# EAGLE schematic main (EAGLE 9.6.0)
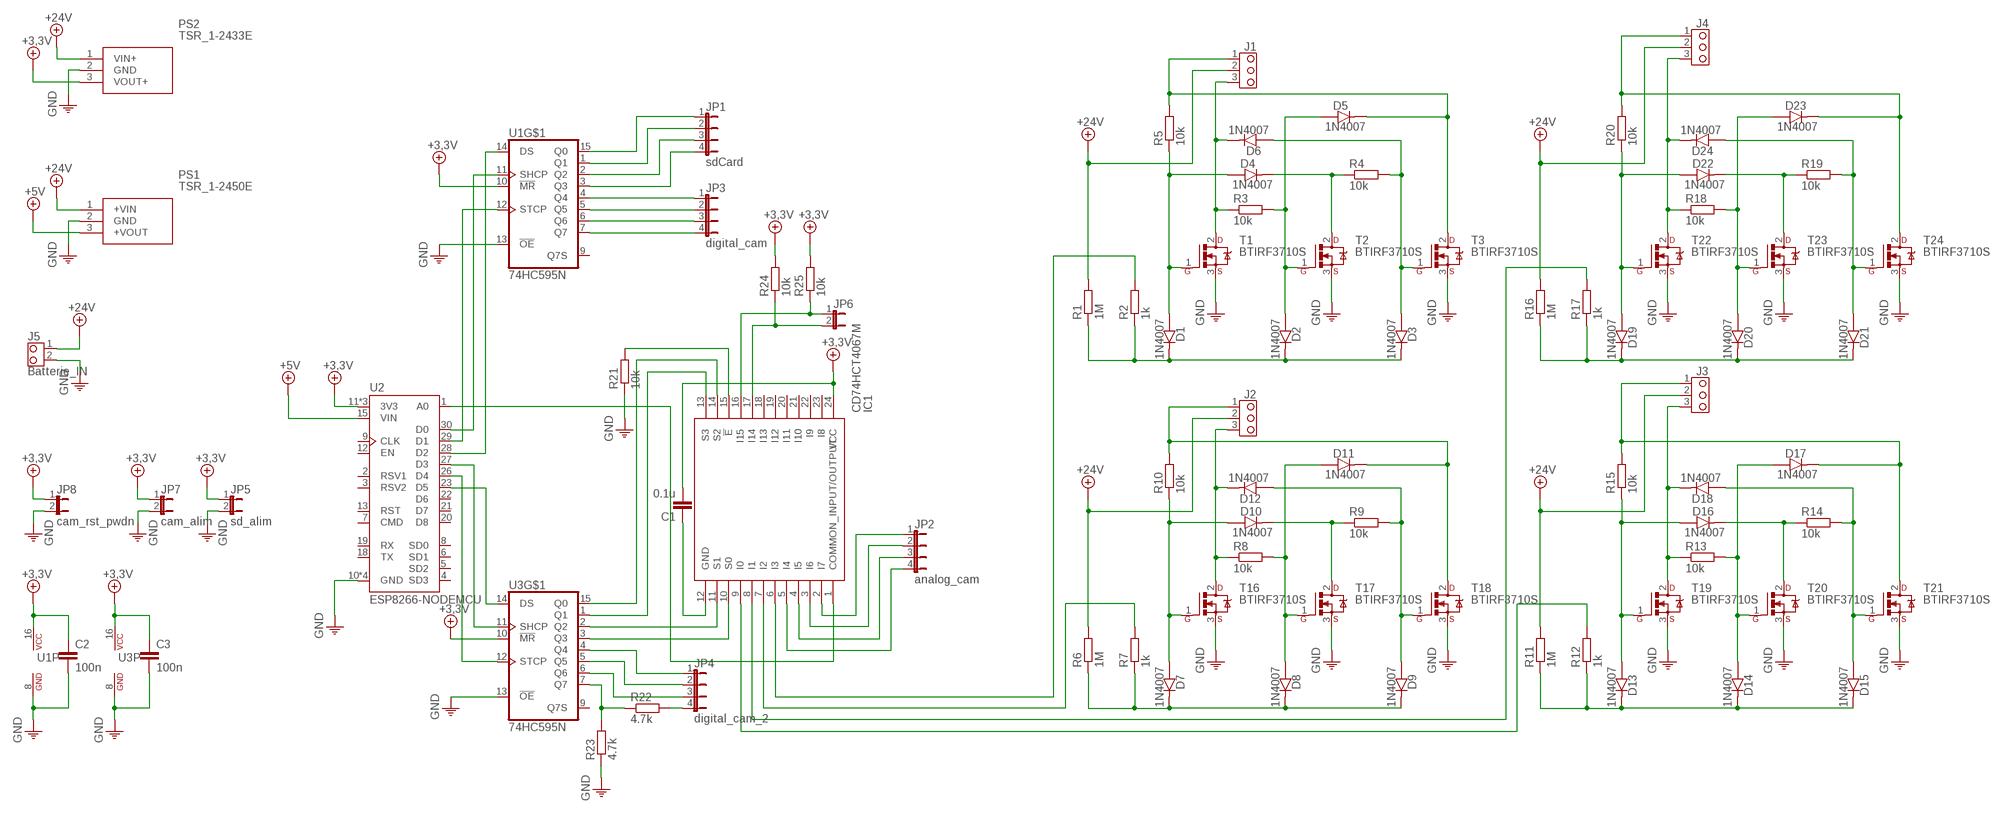
[diagram p0: schematic, sheet 1]

## Parts
C1  0.1u  C-CMS1206  [CCMS1206]
C2  100n  C-CMS1206  [CCMS1206]
C3  100n  C-CMS1206  [CCMS1206]
D1  1N4007  [DO-41-10]
D2  1N4007  [DO-41-10]
D3  1N4007  [DO-41-10]
D4  1N4007  [DO-41-10]
D5  1N4007  [DO-41-10]
D6  1N4007  [DO-41-10]
D7  1N4007  [DO-41-10]
D8  1N4007  [DO-41-10]
D9  1N4007  [DO-41-10]
D10  1N4007  [DO-41-10]
D11  1N4007  [DO-41-10]
D12  1N4007  [DO-41-10]
D13  1N4007  [DO-41-10]
D14  1N4007  [DO-41-10]
D15  1N4007  [DO-41-10]
D16  1N4007  [DO-41-10]
D17  1N4007  [DO-41-10]
D18  1N4007  [DO-41-10]
D19  1N4007  [DO-41-10]
D20  1N4007  [DO-41-10]
D21  1N4007  [DO-41-10]
D22  1N4007  [DO-41-10]
D23  1N4007  [DO-41-10]
D24  1N4007  [DO-41-10]
IC1  CD74HCT4067M  [SOIC127P1030X265-24N]
J1  BORNIER_3-A3P  [AK500/3]
J2  BORNIER_3-A3P  [AK500/3]
J3  BORNIER_3-A3P  [AK500/3]
J4  BORNIER_3-A3P  [AK500/3]
J5  Batterie_IN  BORNIER_2-D2P  [MSTBA2]
JP1  sdCard  JP4E  [JP4]
JP2  analog_cam  JP4E  [JP4]
JP3  digital_cam  JP4E  [JP4]
JP4  digital_cam_2  JP4E  [JP4]
JP5  sd_alim  JP1E  [JP1]
JP6  JP1E  [JP1]
JP7  cam_alim  JP1E  [JP1]
JP8  cam_rst_pwdn  JP1E  [JP1]
PS1  TSR_1-2450E  [TSR12450E]
PS2  TSR_1-2433E  [TSR-1-2433]
R1  1M  R-CMS1206  [RCMS1206]
R2  1k  R-CMS1206  [RCMS1206]
R3  10k  R-CMS1206  [RCMS1206]
R4  10k  R-CMS1206  [RCMS1206]
R5  10k  R-CMS1206  [RCMS1206]
R6  1M  R-CMS1206  [RCMS1206]
R7  1k  R-CMS1206  [RCMS1206]
R8  10k  R-CMS1206  [RCMS1206]
R9  10k  R-CMS1206  [RCMS1206]
R10  10k  R-CMS1206  [RCMS1206]
R11  1M  R-CMS1206  [RCMS1206]
R12  1k  R-CMS1206  [RCMS1206]
R13  10k  R-CMS1206  [RCMS1206]
R14  10k  R-CMS1206  [RCMS1206]
R15  10k  R-CMS1206  [RCMS1206]
R16  1M  R-CMS1206  [RCMS1206]
R17  1k  R-CMS1206  [RCMS1206]
R18  10k  R-CMS1206  [RCMS1206]
R19  10k  R-CMS1206  [RCMS1206]
R20  10k  R-CMS1206  [RCMS1206]
R21  10k  R-CMS1206  [RCMS1206]
R22  4.7k  R-CMS1206  [RCMS1206]
R23  4.7k  R-CMS1206  [RCMS1206]
R24  10k  R-CMS1206  [RCMS1206]
R25  10k  R-CMS1206  [RCMS1206]
T1  BTIRF3710S  [D2PACK]
T2  BTIRF3710S  [D2PACK]
T3  BTIRF3710S  [D2PACK]
T16  BTIRF3710S  [D2PACK]
T17  BTIRF3710S  [D2PACK]
T18  BTIRF3710S  [D2PACK]
T19  BTIRF3710S  [D2PACK]
T20  BTIRF3710S  [D2PACK]
T21  BTIRF3710S  [D2PACK]
T22  BTIRF3710S  [D2PACK]
T23  BTIRF3710S  [D2PACK]
T24  BTIRF3710S  [D2PACK]
U1  74HC595N  [DIL16]
U2  ESP8266-NODEMCU  [ESP8266-NODEMCU]
U3  74HC595N  [DIL16]

## Nets
+3,3V: C1.2 C2.1 C3.1 IC1.24(VCC) JP5.1 JP7.1 JP8.1 PS2.3(VOUT+) R24.2 R25.2 U1.10(!MR!) U1.16(P:VCC) U2.11(3V3) U2.16(3V3) U2.25(3V3) U3.10(!MR!) U3.16(P:VCC)
+5V: PS1.3(+VOUT) U2.15(VIN)
+24V: J1.2 J2.2 J3.2 J4.2 J5.1 PS1.1(+VIN) PS2.1(VIN+) R1.2 R6.2 R11.2 R16.2
GND: C2.2 C3.2 J5.2 JP5.2 JP7.2 JP8.2 PS1.2(GND) PS2.2(GND) R21.1 R23.1 T1.3(S) T2.3(S) T3.3(S) T16.3(S) T17.3(S) T18.3(S) T19.3(S) T20.3(S) T21.3(S) T22.3(S) T23.3(S) T24.3(S) U1.8(P:GND) U1.13(!OE!) U2.10(GND) U2.14(GND) U2.17(GND) U2.24(GND) U3.8(P:GND) U3.13(!OE!)
N$1: D4.C R4.1 T2.2(D)
N$2: D1.C D2.C D3.C R1.1 R2.1
N$3: D1.A D4.A R5.1 T1.1(G)
N$4: D2.A D5.A R3.2 T2.1(G)
N$5: D3.A D6.A R4.2 T3.1(G)
N$6: D6.C J1.3 R3.1 T1.2(D)
N$7: IC1.6(I3) R2.2
N$8: D7.A D10.A R10.1 T16.1(G)
N$9: D5.C J1.1 R5.2 T3.2(D)
N$10: D8.A D11.A R8.2 T17.1(G)
N$11: D7.C D8.C D9.C R6.1 R7.1
N$12: D9.A D12.A R9.2 T18.1(G)
N$13: D10.C R9.1 T17.2(D)
N$14: D12.C J2.3 R8.1 T16.2(D)
N$15: IC1.7(I2) R7.2
N$16: D11.C J2.1 R10.2 T18.2(D)
N$17: D13.A D16.A R15.1 T19.1(G)
N$18: D14.A D17.A R13.2 T20.1(G)
N$19: D13.C D14.C D15.C R11.1 R12.1
N$20: D15.A D18.A R14.2 T21.1(G)
N$21: D16.C R14.1 T20.2(D)
N$22: D18.C J3.3 R13.1 T19.2(D)
N$23: IC1.8(I1) R17.2
N$24: D17.C J3.1 R15.2 T21.2(D)
N$25: D19.A D22.A R20.1 T22.1(G)
N$26: D20.A D23.A R18.2 T23.1(G)
N$27: D19.C D20.C D21.C R16.1 R17.1
N$28: D21.A D24.A R19.2 T24.1(G)
N$29: D22.C R19.1 T23.2(D)
N$30: D24.C J4.3 R18.1 T22.2(D)
N$31: IC1.9(I0) R12.2
N$32: D23.C J4.1 R20.2 T24.2(D)
N$33: JP1.1 U1.15(Q0)
N$34: JP1.2 U1.1(Q1)
N$35: JP1.3 U1.2(Q2)
N$36: JP1.4 U1.3(Q3)
N$37: IC1.13(S3) U3.1(Q1)
N$38: C1.1 IC1.12(GND)
N$39: IC1.14(S2) U3.15(Q0)
N$40: IC1.11(S1) U3.2(Q2)
N$41: IC1.10(S0) U3.3(Q3)
N$42: IC1.1(COMMON_INPUT/OUTPUT) U2.1(A0)
N$43: IC1.15(!E) R21.2
N$44: U1.11(SHCP) U2.30(D0)
N$45: U1.12(STCP) U2.29(D1)
N$46: U1.14(DS) U2.28(D2)
N$47: JP3.1 U1.4(Q4)
N$48: JP3.2 U1.5(Q5)
N$49: JP3.3 U1.6(Q6)
N$50: JP3.4 U1.7(Q7)
N$51: IC1.5(I4) JP2.4
N$52: IC1.4(I5) JP2.3
N$53: IC1.3(I6) JP2.2
N$54: IC1.2(I7) JP2.1
N$55: U2.27(D3) U3.11(SHCP)
N$56: U2.26(D4) U3.12(STCP)
N$57: U2.23(D5) U3.14(DS)
N$58: JP4.1 U3.4(Q4)
N$59: JP4.2 U3.5(Q5)
N$60: JP4.3 U3.6(Q6)
N$61: JP4.4 R22.2
N$62: IC1.16(I15) JP6.1 R25.1
N$63: R22.1 R23.2 U3.7(Q7)
N$64: IC1.17(I14) JP6.2 R24.1
Unconnected: IC1.18(I13) IC1.19(I12) IC1.20(I11) IC1.21(I10) IC1.22(I9) IC1.23(I8) U1.9(Q7S) U2.2(RSV1) U2.3(RSV2) U2.4(SD3) U2.5(SD2) U2.6(SD1) U2.7(CMD) U2.8(SD0) U2.9(CLK) U2.12(EN) U2.13(RST) U2.18(TX) U2.19(RX) U2.20(D8) U2.21(D7) U2.22(D6) U3.9(Q7S)

## Library data of the parts
C1-C3 = 0IUT RLCQ:C: Condensateur non Polarisé, Symbole Européen Voir les valeurs sur site Magasin: http://geii/magasin GEII/IUT ANGERS; MAGASIN: (MAG-CMS)
D1-D24 = 0IUT DT:1N4007: DIODE de Redressement Vr: 1000V I: 1A Doc constructeur <http://geii/magasin/pdf/1N4007.pdf> Détails/équivalence: http://geii/composants/ GEII/IUT ANGERS; MAGASIN: DIODES (Tiroirs n°4-5)
IC1 = CD74HCT4067M:CD74HCT4067M: High-speed CMOS 16-channel analog multiplexer & demultiplexer with TTL inputs Source: Datasheet <http://www.ti.com/lit/gpn/cd74hct4067>; DESCRIPTION: High-speed CMOS 16-channel analog multiplexer & demultiplexer with TTL inputs; HEIGHT: 2.65mm; MANUFACTURER_NAME: Texas Instruments; MANUFACTURER_PART_NUMBER: CD74HCT4067M; MOUSER_PART_NUMBER: 595-CD74HCT4067M; MOUSER_PRICE-STOCK: https://www.mouser.co.uk/ProductDetail/Texas-Instruments/CD74HCT4067M?qs=vul0MlC%2Fa1fex%2F7NLRWpgQ%3D%3D
J1-J4 = 0IUT CONNECTEURS:BORNIER_3: BORNIER, 3 Contacts GEII/IUT ANGERS; MAGASIN: Bornier A3P (Armoire n°4)
J5 = 0IUT CONNECTEURS:BORNIER_2: BORNIER, 2 Contacts GEII/IUT ANGERS; MAGASIN: Bornier D2P (Armoire n°4) Bornier D2PF (Armoire n°4)
JP1-JP4 = jumper:JP4E: JUMPER
JP5-JP8 = jumper:JP1E: JUMPER
PS1 = TSR_1-2450E:TSR_1-2450E: 1 Amp POL converter, industrial, 6-36 VDC input, pos.-pos. circuit, cost efficient, LM78 compatible, SIP-3 Source: Datasheet <https://tracopower.com/tsr1e-datasheet/>; DESCRIPTION: 1 Amp POL converter, industrial, 6-36 VDC input, pos.-pos. circuit, cost efficient, LM78 compatible, SIP-3; HEIGHT: 10.6mm; MANUFACTURER_NAME: Traco Power; MANUFACTURER_PART_NUMBER: TSR 1-2450E; MOUSER_PART_NUMBER: 495-TSR1-2450E; MOUSER_PRICE-STOCK: https://www.mouser.co.uk/ProductDetail/TRACO-Power/TSR-1-2450E?qs=vmHwEFxEFR%2FlQnbAtEoeVA%3D%3D
PS2 = TSR_1-2433E:TSR_1-2433E: 1 Amp POL converter, industrial, 6-36 VDC input, pos.-pos. circuit, cost efficient, LM78 compatible, SIP-3 Source: Datasheet <https://tracopower.com/tsr1e-datasheet/>; DESCRIPTION: 1 Amp POL converter, industrial, 6-36 VDC input, pos.-pos. circuit, cost efficient, LM78 compatible, SIP-3; HEIGHT: mm; MANUFACTURER_NAME: Traco Power; MANUFACTURER_PART_NUMBER: TSR 1-2433E; MOUSER_PART_NUMBER: 495-TSR1-2433E; MOUSER_PRICE-STOCK: https://www.mouser.co.uk/ProductDetail/TRACO-Power/TSR-1-2433E?qs=vmHwEFxEFR9haWIzn8wG3A%3D%3D
R1-R25 = 0IUT RLCQ:R: Résistance Européenne Voir les valeurs sur site Magasin: http://geii/magasin GEII/IUT ANGERS; MAGASIN: (MAG-CMS)
T1-T3 T16-T24 = librairie_drone:BTIRF3710S
U1 U3 = 0IUT CI LOGIQUES:74HC595: REGISTRE à décalage, 8 bits, Série vers Parallèle ou Série Doc constructeur <http://geii/magasin/pdf/74HC595.pdf> GEII/IUT ANGERS; MAGASIN: 74 HC 595 (Armoire n°4) KYT 16 (Armoire n°5)
U2 = 0IUT xPROJETS:ESP8266-NODEMCU: Module Wifi NodeMCU ESP8266 Doc constructeur <http://geii/magasin/pdf/ESP8266-NODEMCU.pdf> GEII/IUT ANGERS; LIB: DIV